# EAGLE schematic Project_5 (EAGLE 9.6.2)
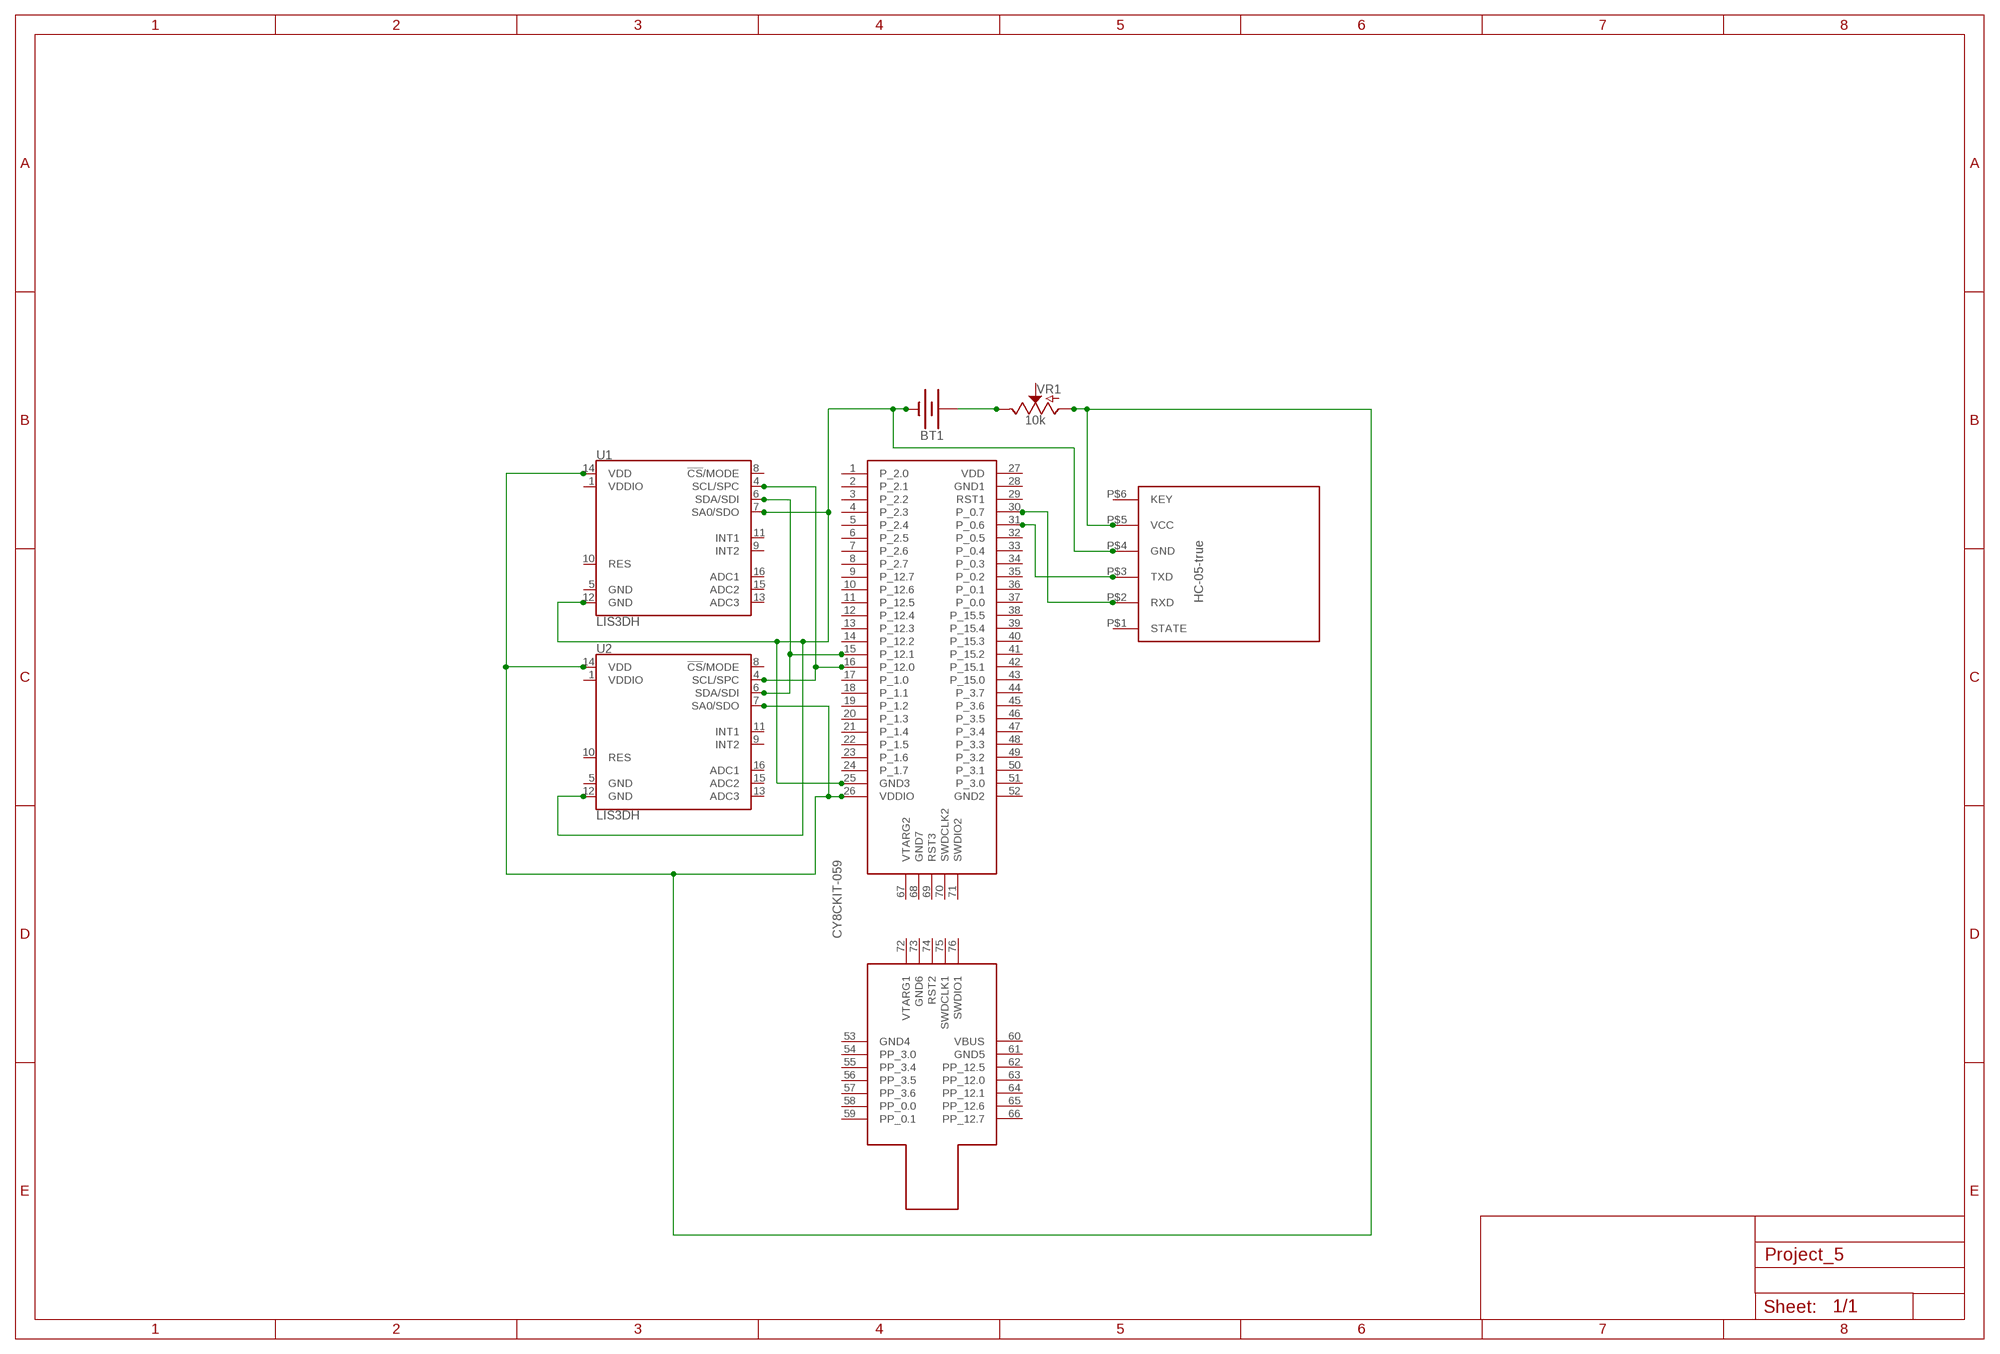
[diagram p0: schematic, sheet 1]

## Parts
BT1  BATTERY-9V  [BATTCON_9V]
U1  LIS3DH  [LGA-16-3X3]
U2  LIS3DH  [LGA-16-3X3]
U$1  CY8CKIT-059  [CY8CKIT-059]
U$2  HC  [HC-05]
VR1  10k  POTENTIOMETER-PTH-9MM-1/20W-20%-KIT  [POT-PTH-ALPS-KIT]

## Nets
N$1: U1.4(SCL/SPC) U2.4(SCL/SPC) U$1.16(P_12.0)
N$2: BT1.- U1.7(SA0/SDO) U1.12(GND) U2.12(GND) U$1.25(GND3) U$2.P$4(GND)
N$3: U$1.30(P_0.7) U$2.P$2(RXD)
N$4: U$1.31(P_0.6) U$2.P$3(TXD)
N$5: U1.14(VDD) U2.7(SA0/SDO) U2.14(VDD) U$1.26(VDDIO) U$2.P$5(VCC) VR1.P$3(A)
N$6: BT1.+ VR1.P$1(E)
N$7: U1.6(SDA/SDI) U2.6(SDA/SDI) U$1.15(P_12.1)
Unconnected: U1.1(VDDIO) U1.5(GND) U1.8(!CS!/MODE) U1.9(INT2) U1.10(RES) U1.11(INT1) U1.13(ADC3) U1.15(ADC2) U1.16(ADC1) U2.1(VDDIO) U2.5(GND) U2.8(!CS!/MODE) U2.9(INT2) U2.10(RES) U2.11(INT1) U2.13(ADC3) U2.15(ADC2) U2.16(ADC1) U$1.1(P_2.0) U$1.2(P_2.1) U$1.3(P_2.2) U$1.4(P_2.3) U$1.5(P_2.4) U$1.6(P_2.5) U$1.7(P_2.6) U$1.8(P_2.7) U$1.9(P_12.7) U$1.10(P_12.6) U$1.11(P_12.5) U$1.12(P_12.4) U$1.13(P_12.3) U$1.14(P_12.2) U$1.17(P_1.0) U$1.18(P_1.1) U$1.19(P_1.2) U$1.20(P_1.3) U$1.21(P_1.4) U$1.22(P_1.5) U$1.23(P_1.6) U$1.24(P_1.7) U$1.27(VDD) U$1.28(GND1) U$1.29(RST1) U$1.32(P_0.5) U$1.33(P_0.4) U$1.34(P_0.3) U$1.35(P_0.2) U$1.36(P_0.1) U$1.37(P_0.0) U$1.38(P_15.5) U$1.39(P_15.4) U$1.40(P_15.3) U$1.41(P_15.2) U$1.42(P_15.1) U$1.43(P_15.0) U$1.44(P_3.7) U$1.45(P_3.6) U$1.46(P_3.5) U$1.47(P_3.4) U$1.48(P_3.3) U$1.49(P_3.2) U$1.50(P_3.1) U$1.51(P_3.0) U$1.52(GND2) U$1.53(GND4) U$1.54(PP_3.0) U$1.55(PP_3.4) U$1.56(PP_3.5) U$1.57(PP_3.6) U$1.58(PP_0.0) U$1.59(PP_0.1) U$1.60(VBUS) U$1.61(GND5) U$1.62(PP_12.5) U$1.63(PP_12.0) U$1.64(PP_12.1) U$1.65(PP_12.6) U$1.66(PP_12.7) U$1.67(VTARG2) U$1.68(GND7) U$1.69(RST3) U$1.70(SWDCLK2) U$1.71(SWDIO2) U$1.72(VTARG1) U$1.73(GND6) U$1.74(RST2) U$1.75(SWDCLK1) U$1.76(SWDIO1) U$2.P$1(STATE) U$2.P$6(KEY) VR1.P$2(S)

## Library data of the parts
BT1 = SparkFun-Batteries:BATTERY: Battery - Single Cell A variety of battery chemistries, sizes, and footprints. Device List: 20MM_PTH - Coin Cell Battery Holder - 20mm (PTH) <https://www.sparkfun.com/products/783> 6.8MM_PTH - Coin Cell Battery Holder - 6.8MM(SMD) <https://www.digikey.com/product-detail/en/seiko-instruments/MS621FE-FL11E/728-1057-ND/1889208?WT.srch=1&gclid=CNOQ5a6LzdQCFZS2wAodXCkE0g> 12MM_SMD - Coin Cell Battery Holder - 12mm (SMD) <https://www.sparkfun.com/products/10592> 12MM_PTH - Coin Cell Battery Holder - 12mm (PTH) <https://www.sparkfun.com/products/7948> 20MM_SMD - 20mm Coin Cell Battery Holder (SMD) (2 legs) Used on the Big Time Watch Kit <https://www.sparkfun.com/products/11734> 20MM_SMD_4LEGS - Coin Cell Battery Holder - 20mm (SMD) <https://www.sparkfun.com/products/11892> 20MM_SMD_4LEGS_OVERPASTE - Coin Cell Battery Holder - 20mm (SMD) <https://www.sparkfun.com/products/11892> (Over-paste on the legs) 24.5MM_PTH - Coin Cell Battery Holder - 24.5mm (PTH) <https://www.sparkfun.com/products/8863> 9V - 9V Battery Holder - PC Mount Used on the SparkFun SparkPunk Sound Kit <https://www.sparkfun.com/products/11177> and SparkFun SparkPunk Sequencer Kit <https://www.sparkfun.com/products/12707> 18650 - Battery Holder - 18650 (PTH) <https://www.sparkfun.com/products/13113> AA - Battery Holder - 1xAA (PTH) <https://www.sparkfun.com/products/7949> AAA - Battery Holder - 1xAAA (PTH) <https://www.sparkfun.com/products/12718> AA_KIT - Battery Holder - 1xAA (PTH) <https://www.sparkfun.com/products/7949> Special kit package - pads only have exposed copper on one side of the board. AAA_KIT - Battery Holder - 1xAAA (PTH) <https://www.sparkfun.com/products/12718> Special kit package - pads only have exposed copper on one side of the board.; PROD_ID: BATT-10855
U1 U2 = SparkFun-Sensors:LIS3DH: ST Microelectronics LIS3DH 3-Axis ±2/4/8/16g SPI/I2C Accelerometer The LIS3DH is a three axis MEMS linear accelerometer in the "nano" family. It has a digital I2C/SPI serial interface which makes it ideal for using in embedded applications. The device also features ultra low-power operational modes that allow advanced power saving and smart sleep to wake-up functions, built in detections with interrupts, and auxiliary ADC inputs Datasheet-XXXX <http://www.sparkfun.com/datasheets/Sensors/Accelerometer/LIS3DH.pdf> SparkFun Products SparkFun Triple Axis Accelerometer Breakout - LIS3DH <https://www.sparkfun.com/products/10345> (SEN-XXXXX) Triple Axis Accelerometer - LIS3DH <https://www.sparkfun.com/products/9755> (SEN-XXXXX); PROD_ID: IC-13419; SF_ID: N/A
U$1 = CYKIT:CY8CKIT-059: CY8CKIT-059 Layout.
U$2 = hc-05:HC
VR1 = SparkFun-Resistors:POTENTIOMETER: Potentiometer (Pot) Three-terminal potentiometers, with an adjustable wiper and two adjustable resistors. A pot can be used to create a configurable voltage divider, or as a variable resistor. Variants ALPS_POT and ALPS_POT_KIT - PTH, breadboard compatible, 9mm square pots Rotary Potentiometer - Linear (10k ohm) <https://www.sparkfun.com/products/9288> (COM-09288) The KIT variant exposes copper on only one side of the PTH pad, so the part can only be assembled on one side of the PCB. Useful for beginner soldering kits.; PROD_ID: RES-09177; SF_SKU: COM-09288